# EAGLE design Switch_Module (EAGLE 9.5.1)
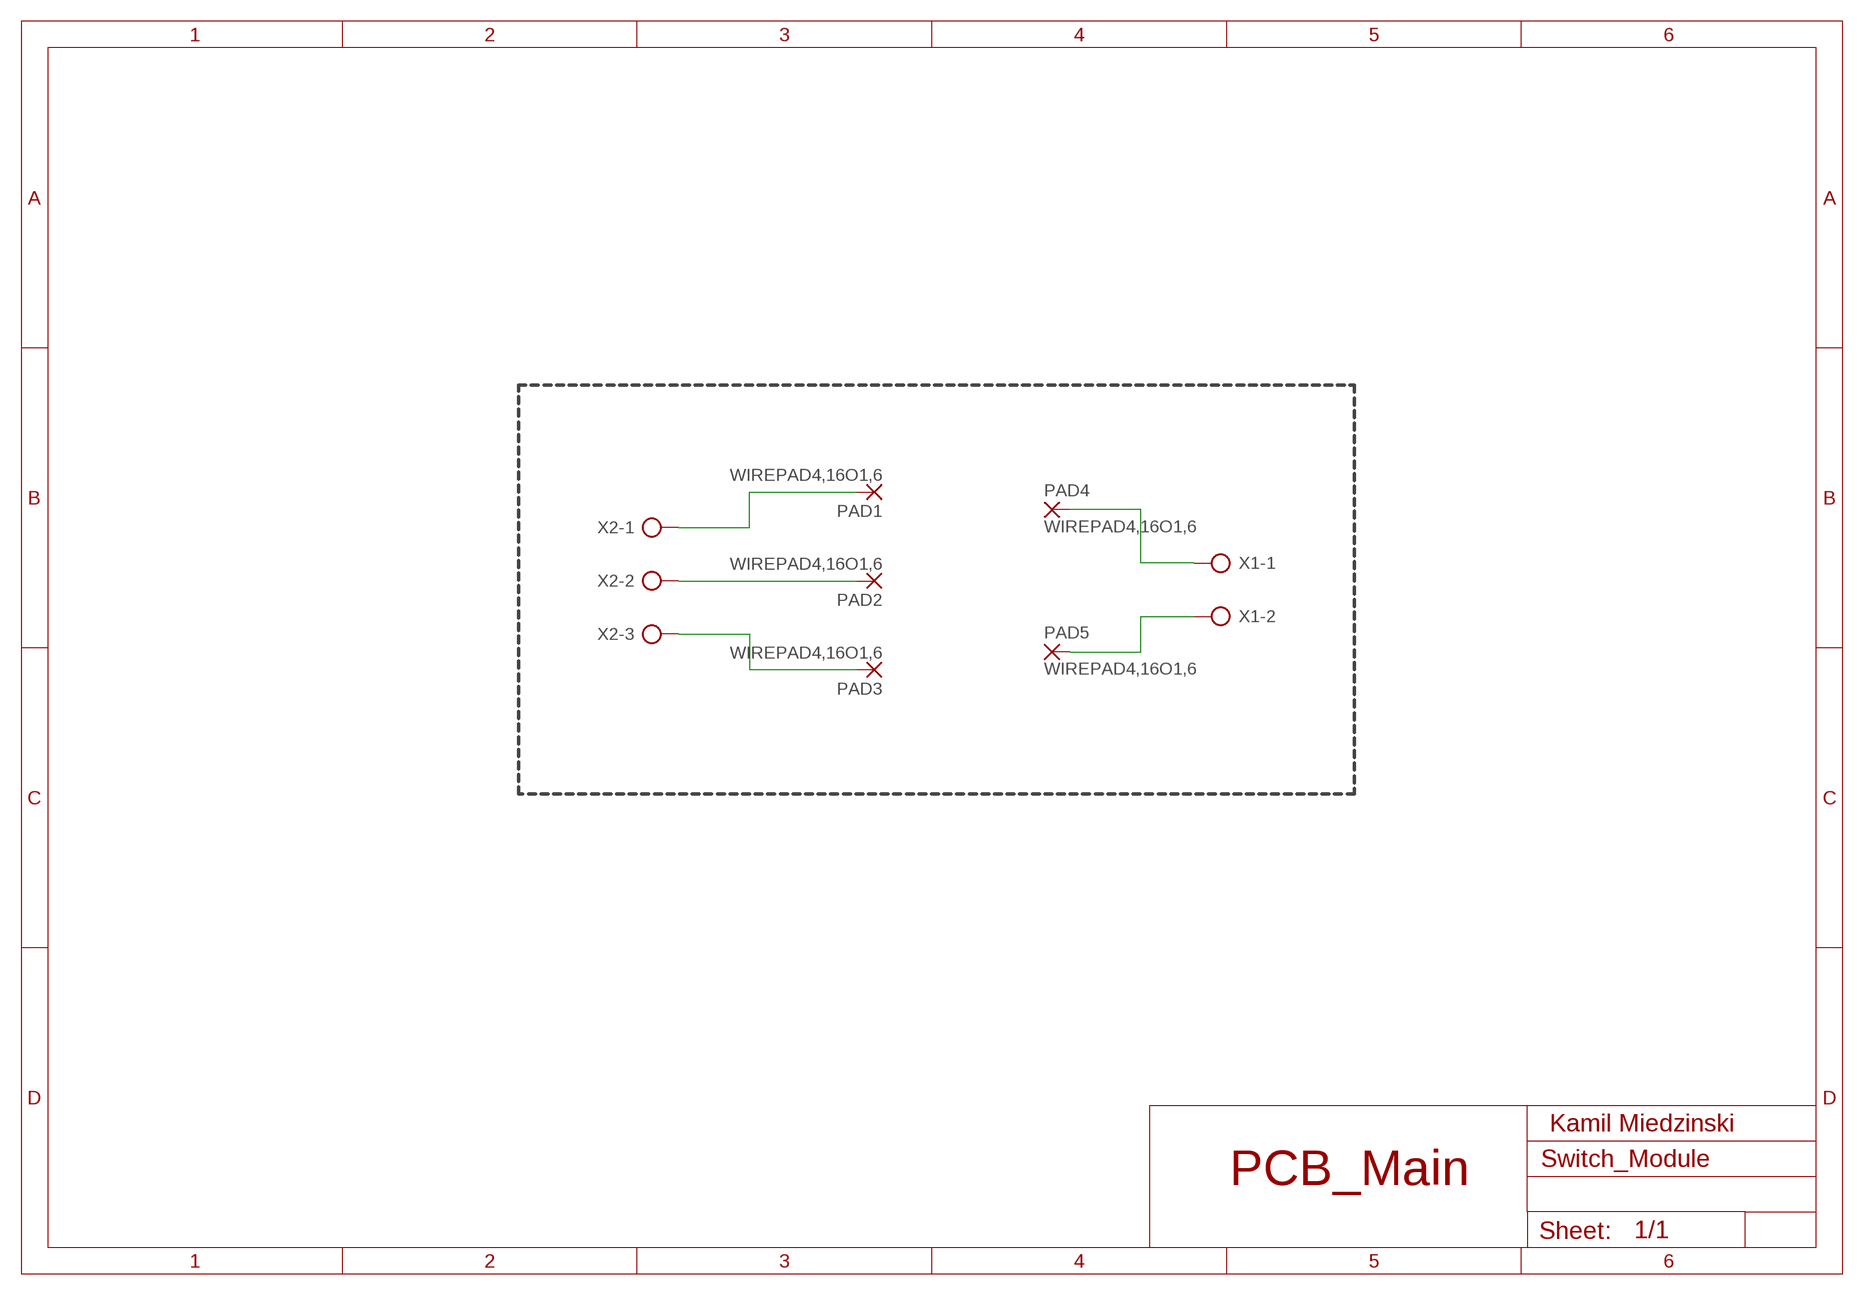
[diagram p0: schematic, sheet 1]

## Parts
PAD1  WIREPAD4,16O1,6  [4,16O1,6]
PAD2  WIREPAD4,16O1,6  [4,16O1,6]
PAD3  WIREPAD4,16O1,6  [4,16O1,6]
PAD4  WIREPAD4,16O1,6  [4,16O1,6]
PAD5  WIREPAD4,16O1,6  [4,16O1,6]
X1  GMKDSP_3/2  [GMKDSP_3/2]
X2  MKDS_3/3  [MKDS_3/3]

## Nets
N$1: PAD1.1(P) X2.1
N$2: PAD2.1(P) X2.2
N$3: PAD3.1(P) X2.3
N$4: PAD4.1(P) X1.1
N$5: PAD5.1(P) X1.2

## Notes on the sheet
- Kamil Miedzinski
- PCB_Main

## Library data of the parts
PAD1-PAD5 = wirepad:WIREPAD: Wire PAD connect wire on PCB
X1 = con-ptr500:GMKDSP_3/2: CONNECTOR; OC_FARNELL: unknown; OC_NEWARK: unknown
X2 = con-ptr500:MKDS_3/3: CONNECTOR; OC_FARNELL: unknown; OC_NEWARK: unknown

## Board
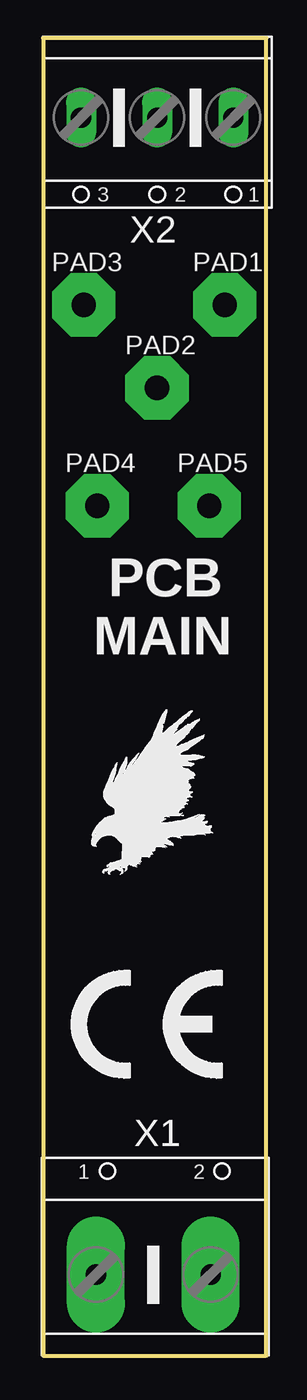
[diagram p1: board, top side]
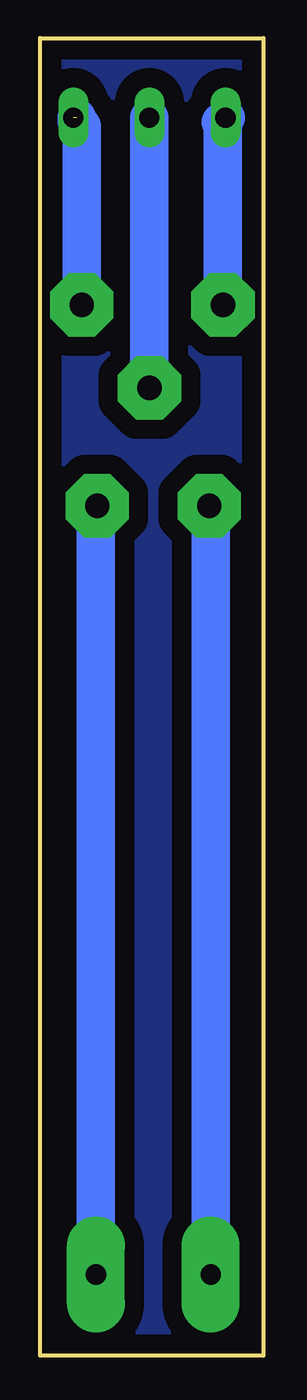
[diagram p2: board, bottom side, seen from below]

Size 14.68 x 86.64 mm. Coordinates in mm from the lower left corner, seen from the top.
Outline: 0,86.64 0,0 14.68,0 14.68,86.64 0,86.64
Copper layers (1*16): Top 0.035mm / dielectric 1.5mm / Bottom 0.035mm
Design rules "default": minimum track width 6mil, minimum drill 0.35mm, track to track 6mil, track to pad 6mil, pad to pad 6mil, via to via 6mil, smd to smd 6mil, copper to edge 40mil, drill to drill 6mil, minimum pad ring 10mil, minimum via ring 8mil, stop-mask expansion 4mil, vias tented up to drill 0mil, thermal gap 10mil

### Footprints (pad centres in the part's own frame; a part is rotated, then mirrored left to right if it is on the bottom)
4,16O1,6 = drill 1.6 pad 4.166 octagon: 1 0,0
GMKDSP_3/2 = drill 1.321 pad 3.81 long: 1 -3.765,0; 2 3.765,0
MKDS_3/3 = drill 1.321 long: 1 -5.004,0; 2 0,0; 3 5.004,0

### Placement (x,y rotation side)
PAD1  11.94,69.09 0 top
PAD2  7.49,63.63 0 top
PAD3  2.67,69.09 0 top
PAD4  3.56,55.88 0 top
PAD5  10.92,55.88 0 top
U$1  [CE_7.3MM]  1.78,18.16 0 top
U$2  [EAGLE-PLC-8MM]  3.17,31.62 0 top
X1  7.24,5.33 0 top
X2  7.49,81.41 180 top

### Tracks (layer width: path | path; a pad name or v marks a point on that pad's centre or on a via)
N$1  (1 unrouted)
  Bottom 2.54: PAD1.1 11.94,80.85 12.27,81.18 12.27,81.41
N$2
  Bottom 2.54: PAD2.1 X2.2
N$3
  Bottom 2.54: X2.3 2.79,81.1 2.67,80.97 PAD3.1
N$4
  Bottom 2.54: X1.1 3.47,55.8 PAD4.1
N$5
  Bottom 2.54: X1.2 11,55.8 PAD5.1
N$6
  pour Bottom (isolate 1.27): 14.68,0 0,0 0,86.64 14.68,86.64

### Text on the board
tNames: PCB / MAIN